# Altium schematic sheet Sheet1.SchDoc
size A3; SheetNumber: 2; SheetTotal: 2
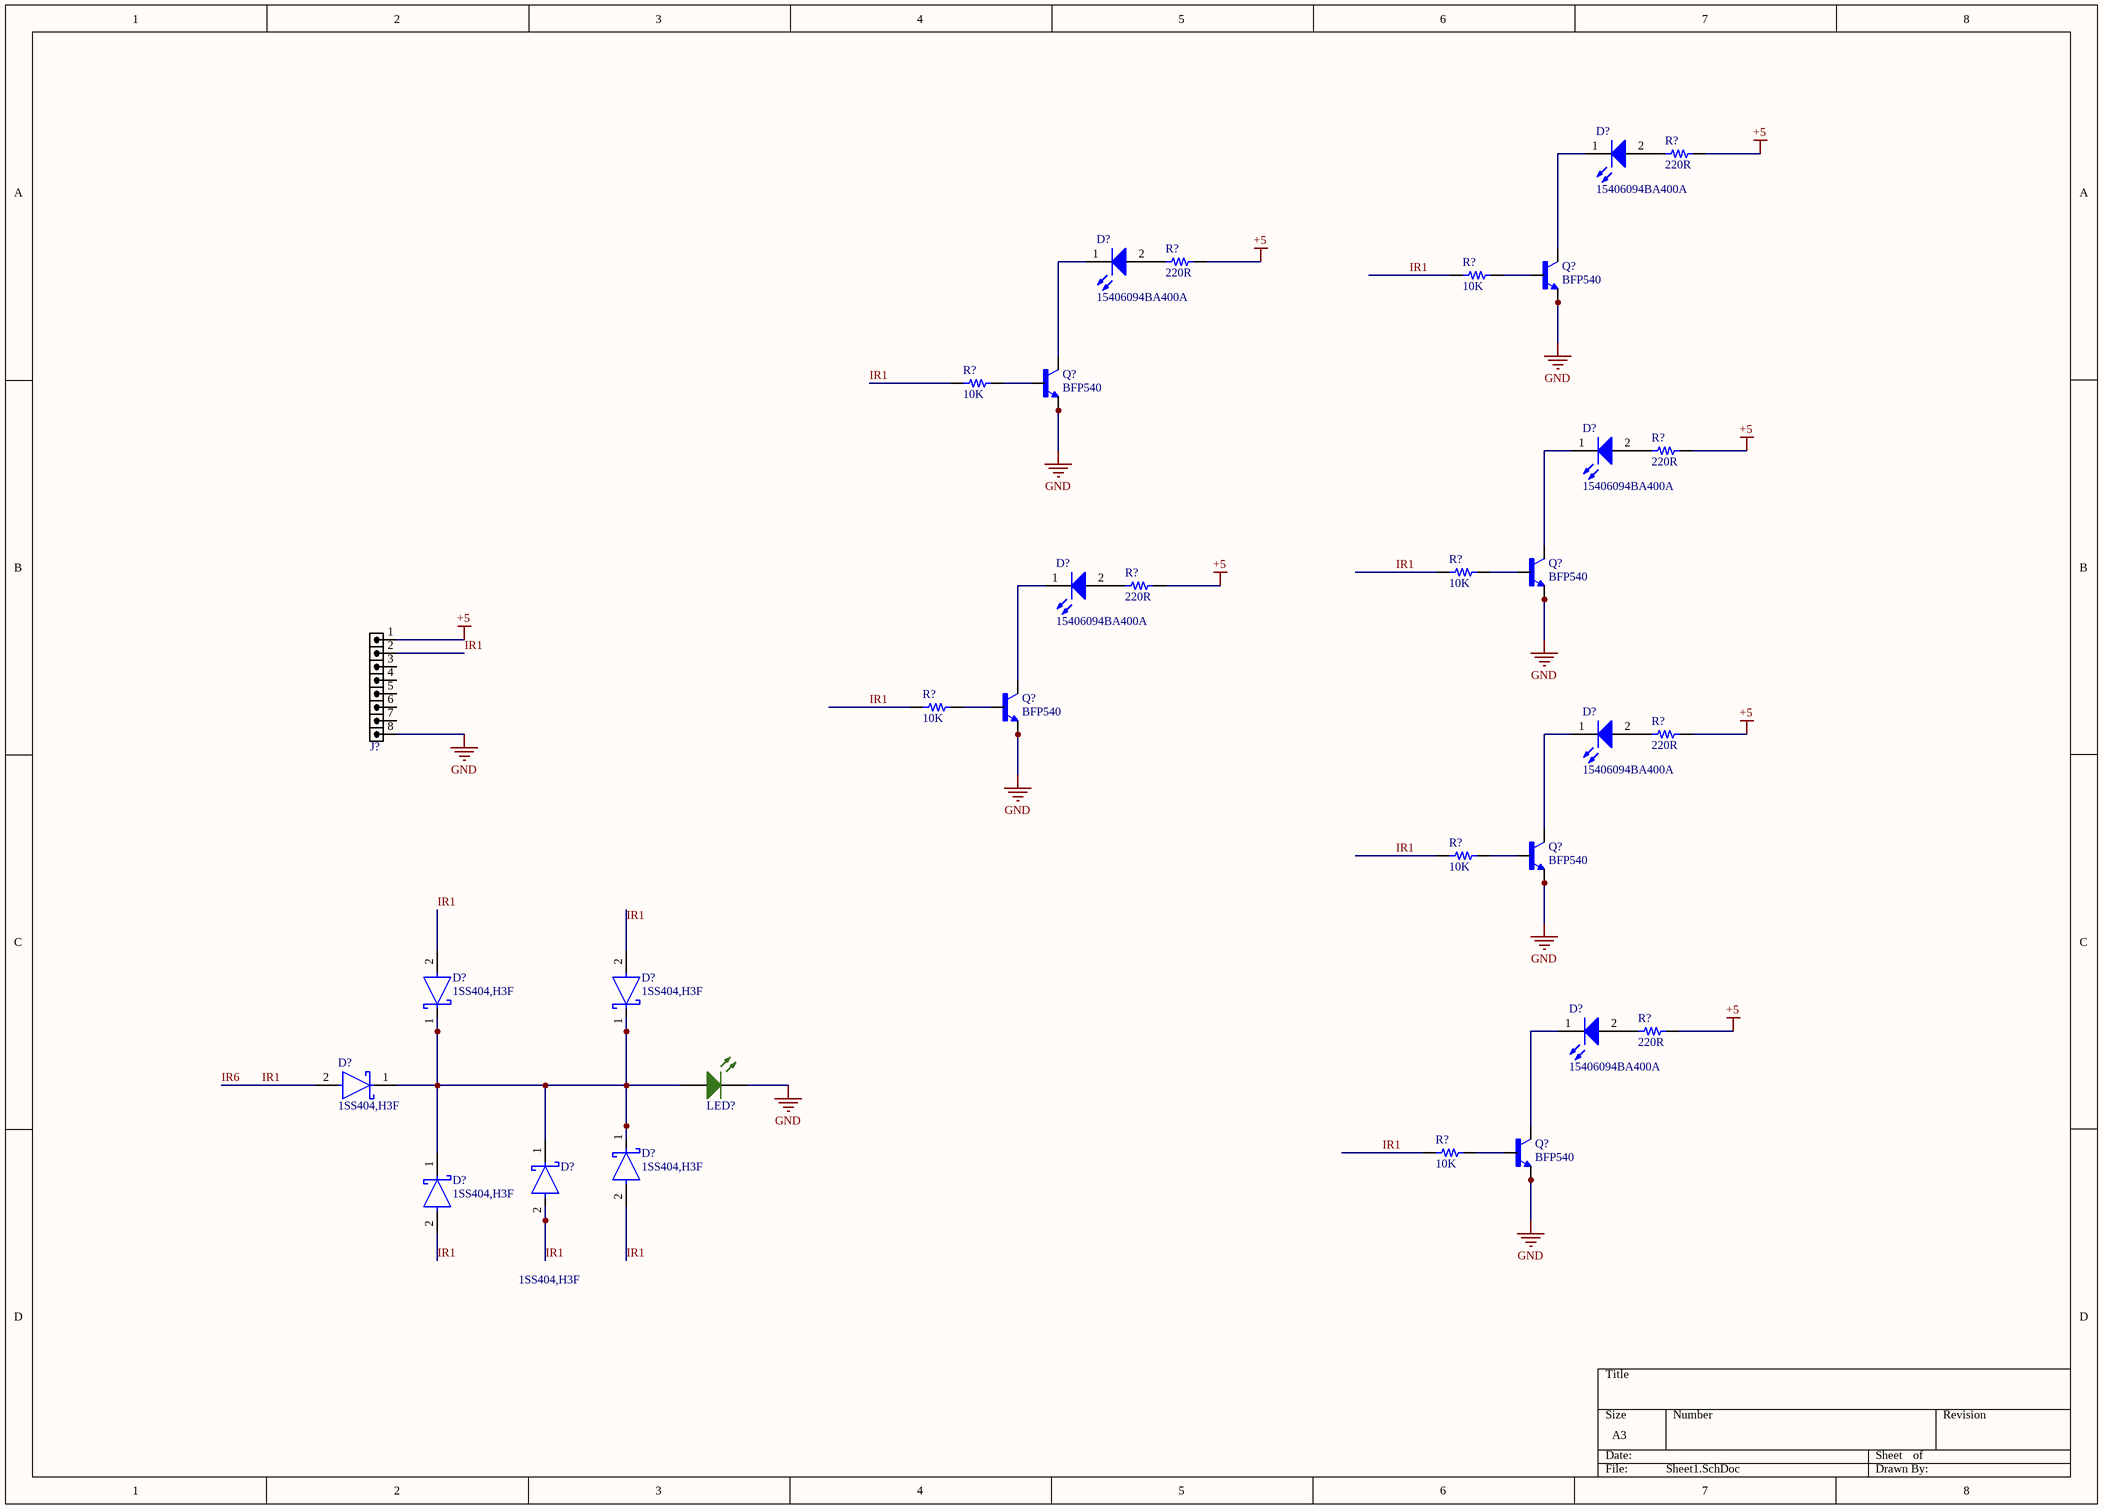
[diagram p0: Sheet1.SchDoc]

## Parts
(Parts that share a designator on the sheet are numbered #1, #2 ... from top to bottom, then left to right.)
D?#1  15406094BA400A  [WL-SICW_0603_L1.6W0.8H0.88]
D?#2  15406094BA400A  [WL-SICW_0603_L1.6W0.8H0.88]
D?#3  15406094BA400A  [WL-SICW_0603_L1.6W0.8H0.88]
D?#4  15406094BA400A  [WL-SICW_0603_L1.6W0.8H0.88]
D?#5  15406094BA400A  [WL-SICW_0603_L1.6W0.8H0.88]
D?#6  1SS404,H3F  [FP-SOD-323-MFG]
D?#7  1SS404,H3F  [FP-SOD-323-MFG]
D?#8  15406094BA400A  [WL-SICW_0603_L1.6W0.8H0.88]
D?#9  1SS404,H3F  [FP-SOD-323-MFG]
D?#10  1SS404,H3F  [FP-SOD-323-MFG]
D?#11  1SS404,H3F  [FP-SOD-323-MFG]
D?#12  1SS404,H3F  [FP-SOD-323-MFG]
J?  HDR1X8  [HDRR_M_1X8]  (value not drawn)
LED?  LED SMD 0603 GREEN  [LED_0603_GREEN]  (value not drawn)
Q?#1  BFP540  [TRANS_BFP540]
Q?#2  BFP540  [TRANS_BFP540]
Q?#3  BFP540  [TRANS_BFP540]
Q?#4  BFP540  [TRANS_BFP540]
Q?#5  BFP540  [TRANS_BFP540]
Q?#6  BFP540  [TRANS_BFP540]
R?#1  220R  [RES 0603_1608]
R?#2  220R  [RES 0603_1608]
R?#3  10K  [RES 0603_1608]
R?#4  10K  [RES 0603_1608]
R?#5  220R  [RES 0603_1608]
R?#6  10K  [RES 0603_1608]
R?#7  220R  [RES 0603_1608]
R?#8  10K  [RES 0603_1608]
R?#9  220R  [RES 0603_1608]
R?#10  10K  [RES 0603_1608]
R?#11  220R  [RES 0603_1608]
R?#12  10K  [RES 0603_1608]

## Nets
+5: J?.1 R?#1.1 R?#2.1 R?#5.1 R?#7.1 R?#9.1 R?#11.1
GND: J?.8 LED?.2(K) Q?#1.2(E) Q?#1.4(E) Q?#2.2(E) Q?#2.4(E) Q?#3.2(E) Q?#3.4(E) Q?#4.2(E) Q?#4.4(E) Q?#5.2(E) Q?#5.4(E) Q?#6.2(E) Q?#6.4(E)
IR1: D?#6.2(A) D?#7.2(A) D?#9.2(A) D?#10.2(A) D?#11.2(A) D?#12.2(A) J?.2 R?#3.2 R?#4.2 R?#6.2 R?#8.2 R?#10.2 R?#12.2  [also labelled IR6]
NetD?#1_1: D?#1.1(K) Q?#1.3(C)
NetD?#1_2: D?#1.2(A) R?#1.2
NetD?#2_1: D?#2.1(K) Q?#2.3(C)
NetD?#2_2: D?#2.2(A) R?#2.2
NetD?#3_1: D?#3.1(K) Q?#3.3(C)
NetD?#3_2: D?#3.2(A) R?#5.2
NetD?#4_1: D?#4.1(K) Q?#4.3(C)
NetD?#4_2: D?#4.2(A) R?#7.2
NetD?#5_1: D?#5.1(K) Q?#5.3(C)
NetD?#5_2: D?#5.2(A) R?#9.2
NetD?#6_1: D?#6.1(C) D?#7.1(C) D?#9.1(C) D?#10.1(C) D?#11.1(C) D?#12.1(C) LED?.1(A)
NetD?#8_1: D?#8.1(K) Q?#6.3(C)
NetD?#8_2: D?#8.2(A) R?#11.2
NetQ?#1_1: Q?#1.1(B) R?#3.1
NetQ?#2_1: Q?#2.1(B) R?#4.1
NetQ?#3_1: Q?#3.1(B) R?#6.1
NetQ?#4_1: Q?#4.1(B) R?#8.1
NetQ?#5_1: Q?#5.1(B) R?#10.1
NetQ?#6_1: Q?#6.1(B) R?#12.1

Not connected (* = marked no-connect by the designer): J? 3 4 5 6 7

## Library data of the parts
D?#1-D?#5 D?#8 = CMP-03913-108242140-1: 15406094BA400A Ir Emitter, 940Nm, 0603 Rohs Compliant: Yes; Max Reverse Voltage (DC): 5V; Forward Current: 700mA; Forward Voltage: 1.2V; Viewing Angle: 140°; RoHS: Compliant; Peak Wavelength: 940nm; Width: 800µm; Min Operating Temperature: -40°C; NexarPartId: 108242140; Length: 1.6mm; Max Operating Temperature: 85°C; Height: 900µm
D?#6 D?#7 D?#9-D?#12 = CMP-35905-000002-1: DIODE SCHOTTKY 20V 300MA USC; Max Repetitive Reverse Voltage (Vrrm): 25V; Element Configuration: Single; Mount: Surface Mount; Max Reverse Voltage (DC): 20V; Forward Current: 300mA; Packaging: Tape and Reel; Case/Package: SOD; Max Operating Temperature: 100°C; Min Operating Temperature: -40°C; Contact Plating: Tin; Average Rectified Current: 300mA
J? = HDRR_M_1X8: CONN, HEADER, RightAngle, Male, pitch: 2.54mm, 8POS; VALUE: HDRM8
Q?#1-Q?#6 = BFP540: RF Transistor NPN 5V 80mA 30GHz 250mW Surface Mount PG-SOT343-4; MF: Infineon; Package: SOT-343 Infineon; Price: None; Check_prices: https://www.snapeda.com/parts/BFP540/Infineon/view-part/?ref=eda; Value: *; SnapEDA_Link: https://www.snapeda.com/parts/BFP540/Infineon/view-part/?ref=snap; MP: BFP540; Availability: In Stock; Purchase-URL: https://pricing.snapeda.com/search/part/BFP540/?ref=eda
R?#1-R?#12 = Res 0603: SMT Resistor; VALUE: 1K